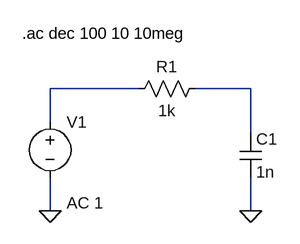
[diagram p0: schematic ac_math.asc]
ac_math.asc, the LTspice schematic file:
Version 4
SHEET 1 880 680
WIRE 128 160 0 160
WIRE 288 160 208 160
WIRE 0 208 0 160
WIRE 288 224 288 160
WIRE 0 336 0 288
WIRE 288 336 288 288
FLAG 0 336 0
FLAG 288 336 0
SYMBOL res 112 176 R270
WINDOW 0 32 56 VTop 0
WINDOW 3 0 56 VBottom 0
SYMATTR InstName R1
SYMATTR Value 1k
SYMBOL cap 272 224 R0
SYMATTR InstName C1
SYMATTR Value 1n
SYMBOL voltage 0 192 R0
WINDOW 123 24 132 Left 0
WINDOW 39 0 0 Left 0
SYMATTR Value2 AC 1
SYMATTR InstName V1
SYMATTR Value ""
TEXT -40 80 Left 0 !.ac dec 100 10 10meg

The netlist it stands for:
* ac_math.asc
R1 N001 N002 1k
C1 N002 0 1n
V1 N001 0 AC 1
.ac dec 100 10 10meg
.backanno
.end